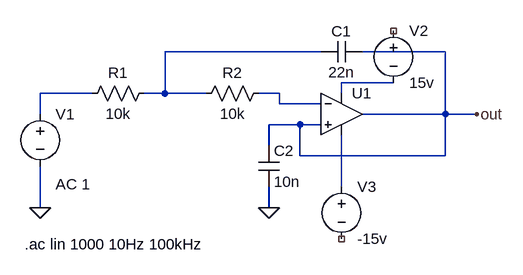
[diagram p0: schematic 二阶低通滤波器.asc]
二阶低通滤波器.asc, the LTspice schematic file:
Version 4.1
SHEET 1 880 680
WIRE 432 0 192 0
WIRE 624 0 496 0
WIRE 544 48 464 48
WIRE 80 64 0 64
WIRE 192 64 192 0
WIRE 192 64 160 64
WIRE 256 64 192 64
WIRE 368 64 336 64
WIRE 464 64 464 48
WIRE 368 80 368 64
WIRE 432 80 368 80
WIRE 0 96 0 64
WIRE 624 96 624 0
WIRE 624 96 496 96
WIRE 672 96 624 96
WIRE 400 112 352 112
WIRE 432 112 400 112
WIRE 352 144 352 112
WIRE 400 160 400 112
WIRE 624 160 624 96
WIRE 624 160 400 160
WIRE 464 208 464 128
WIRE 0 240 0 176
WIRE 352 240 352 208
FLAG 0 240 0
FLAG 352 240 0
FLAG 672 96 out
SYMBOL voltage 0 80 R0
WINDOW 123 24 124 Left 2
WINDOW 39 0 0 Left 0
SYMATTR InstName V1
SYMATTR Value ""
SYMATTR Value2 AC 1
SYMBOL res 176 48 R90
WINDOW 0 0 56 VBottom 2
WINDOW 3 32 56 VTop 2
SYMATTR InstName R1
SYMATTR Value 10k
SYMBOL res 352 48 R90
WINDOW 0 0 56 VBottom 2
WINDOW 3 32 56 VTop 2
SYMATTR InstName R2
SYMATTR Value 10k
SYMBOL cap 496 -16 R90
WINDOW 0 0 32 VBottom 2
WINDOW 3 32 32 VTop 2
SYMATTR InstName C1
SYMATTR Value 22n
SYMBOL cap 336 144 R0
SYMATTR InstName C2
SYMATTR Value 10n
SYMBOL OpAmps\\UniversalOpAmp2 464 96 R0
SYMATTR InstName U1
SYMBOL voltage 544 -48 R0
WINDOW 123 0 0 Left 0
WINDOW 39 0 0 Left 0
SYMATTR InstName V2
SYMATTR Value 15v
SYMBOL voltage 464 192 R0
WINDOW 123 0 0 Left 0
WINDOW 39 0 0 Left 0
SYMATTR InstName V3
SYMATTR Value -15v
TEXT -24 296 Left 2 !.ac lin 1000 10Hz 100kHz

The netlist it stands for:
* 二阶低通滤波器.asc
V1 N003 0 AC 1
R1 N001 N003 10k
R2 N004 N001 10k
C1 out N001 22n
C2 out 0 10n
X§U1 out N004 N002 N005 out level2 Avol=1Meg GBW=10Meg Slew=10Meg Ilimit=25m Rail=0 Vos=0 En=0 Enk=0 In=0 Ink=0 Rin=500Meg  ; pins In+ In- V+ V- OUT
V2 NC_01 N002 15v
V3 N005 NC_02 -15v
.ac lin 1000 10Hz 100kHz
.lib UniversalOpAmp2.lib
.backanno
.end